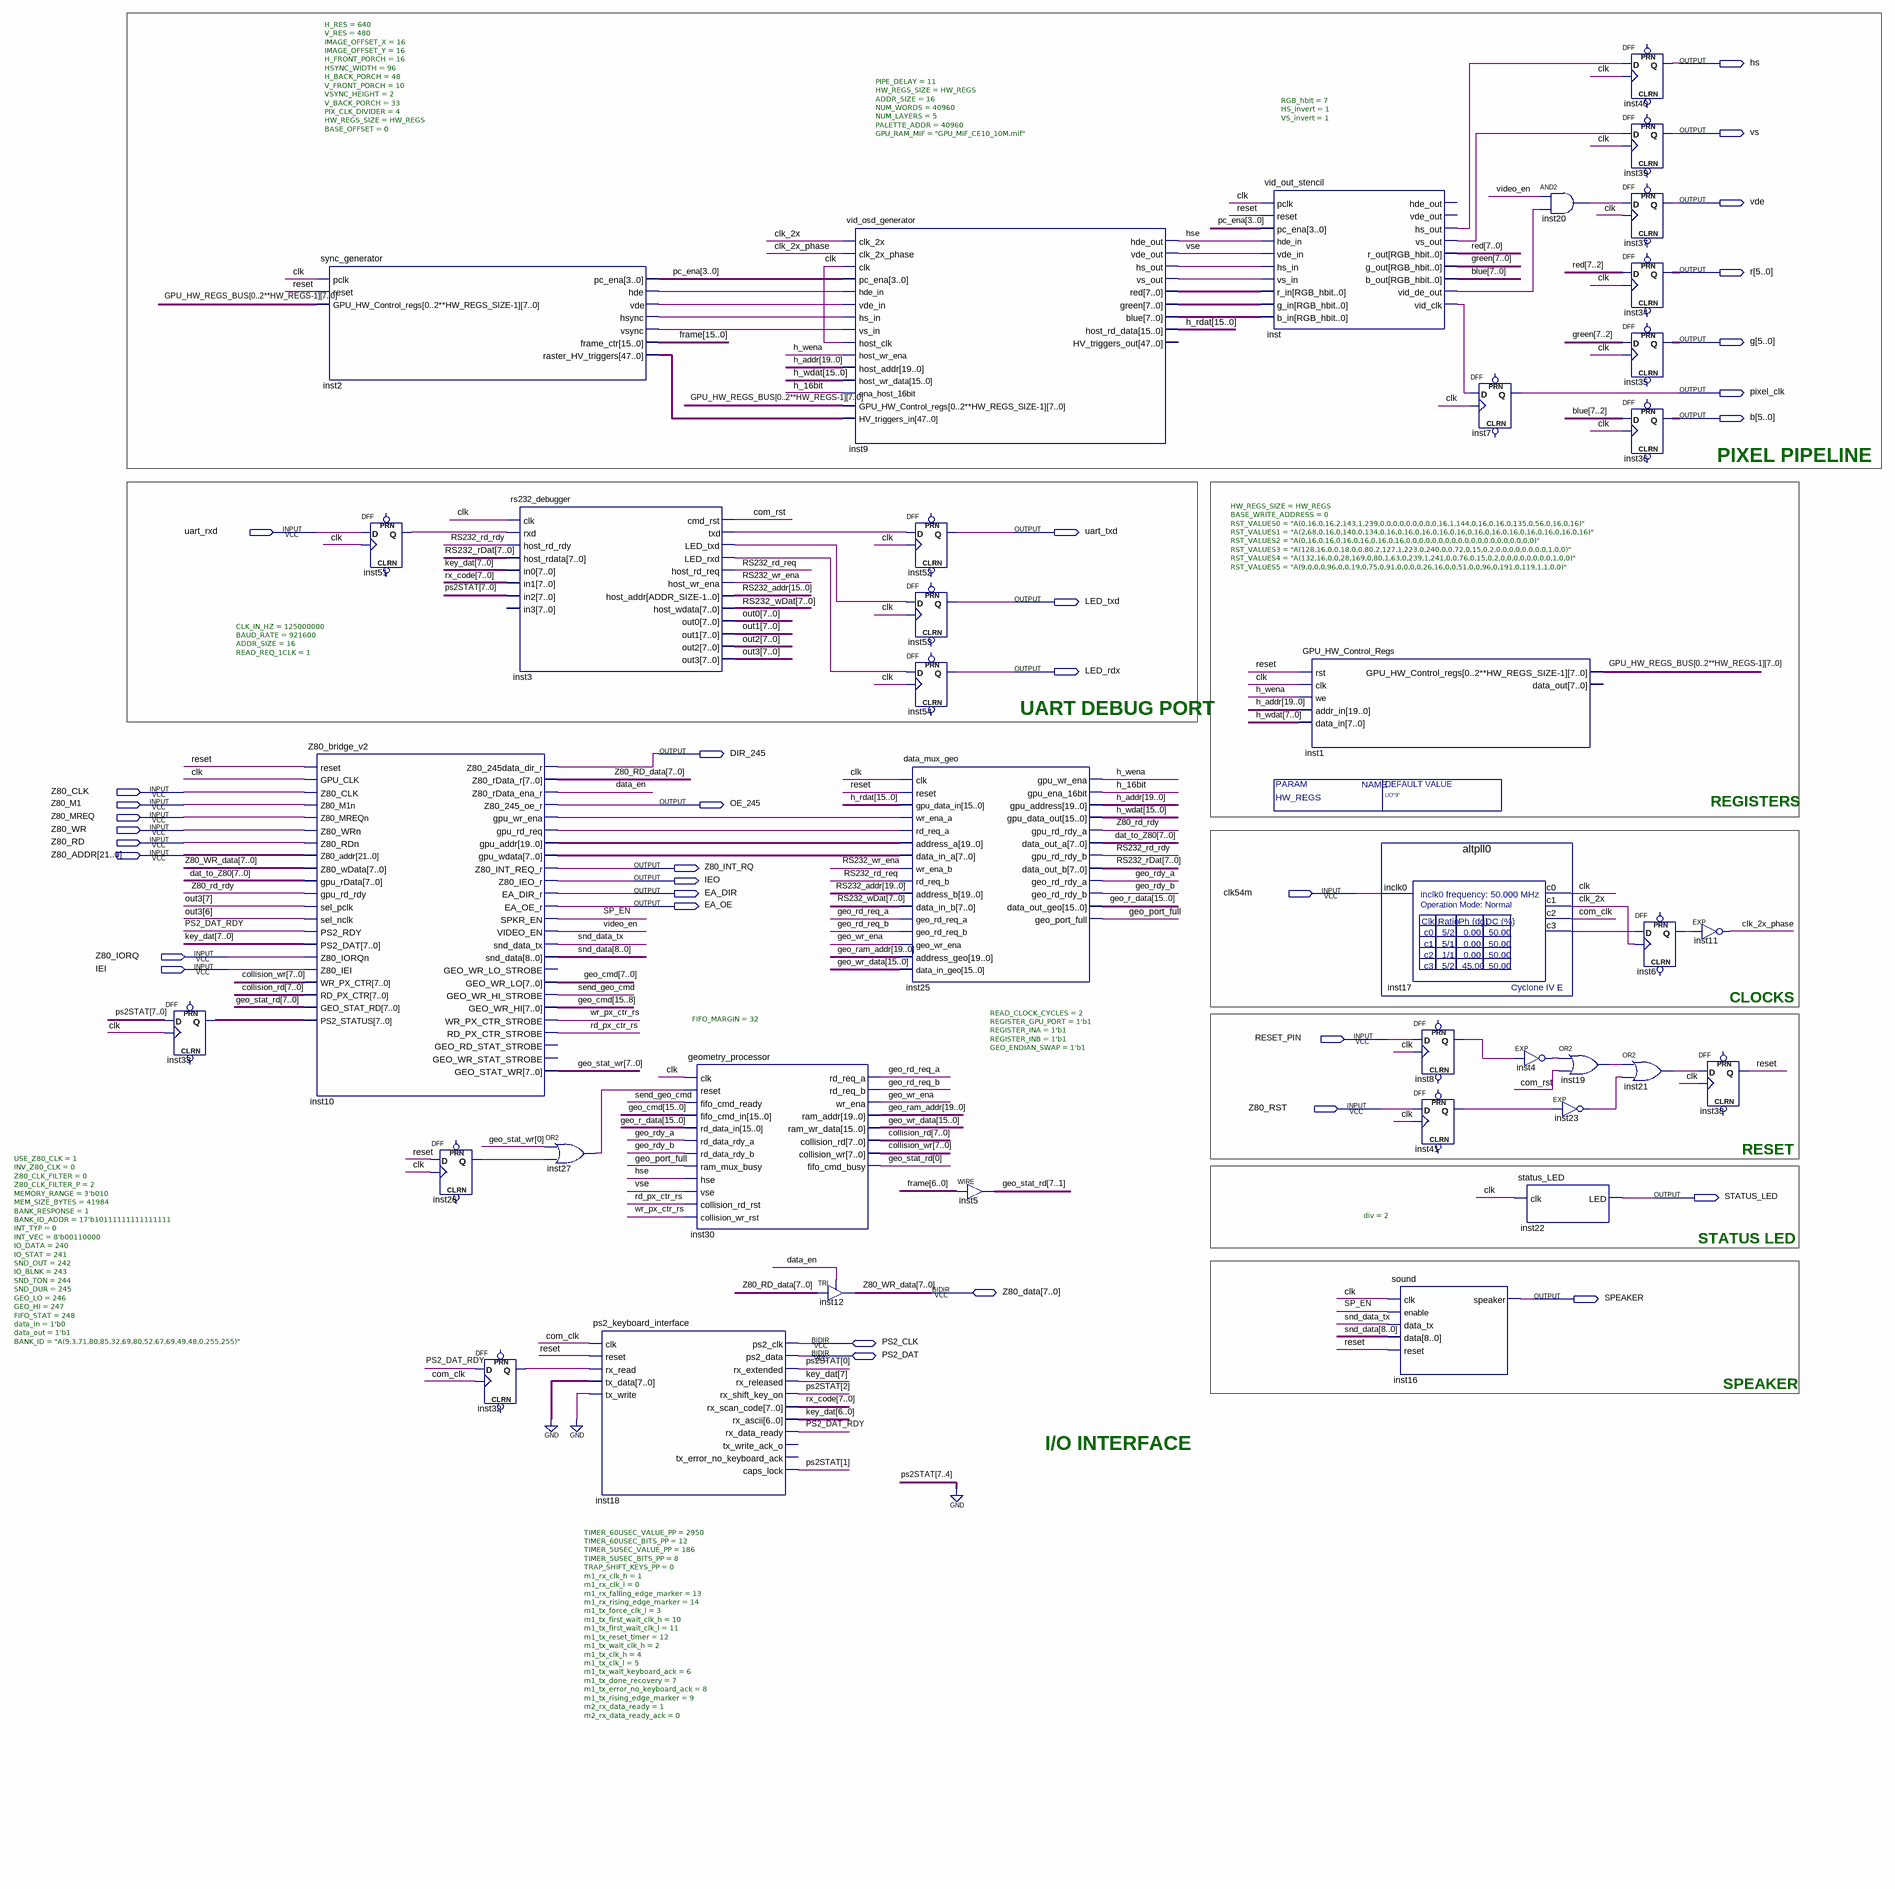
[diagram p0: schematic sheet]
// Quartus schematic GPU.bdf as structural Verilog: 39 symbols, 33 pins
module GPU #(parameter HW_REGS = "UD\"9\"") (
  input  uart_rxd,
  input  Z80_CLK,
  input  Z80_M1,
  input  Z80_MREQ,
  input  Z80_WR,
  input  Z80_RD,
  input  [21:0] Z80_ADDR,
  input  clk54m,
  input  Z80_IORQ,
  input  IEI,
  input  RESET_PIN,
  input  Z80_RST,
  inout  [7:0] Z80_data,
  inout  PS2_CLK,
  inout  PS2_DAT,
  output hs,
  output vs,
  output vde,
  output [5:0] r,
  output [5:0] g,
  output pixel_clk,
  output [5:0] b,
  output uart_txd,
  output LED_txd,
  output LED_rdx,
  output DIR_245,
  output OE_245,
  output Z80_INT_RQ,
  output IEO,
  output EA_DIR,
  output EA_OE,
  output STATUS_LED,
  output SPEAKER
);

  wire clk, clk_2x, clk_2x_phase, com_clk, com_rst, data_en, geo_port_full, geo_rd_req_a, geo_rd_req_b,
       geo_rdy_a, geo_rdy_b, geo_wr_ena, h_16bit, h_wena, hse, inst2_hde, inst2_hsync, inst2_vde,
       inst2_vsync, inst3_led_rxd, inst3_led_txd, inst3_txd, inst4_out, inst6_q, inst8_q, inst9_hs_out,
       inst9_vs_out, inst10_gpu_rd_req, inst10_gpu_wr_ena, inst17_c3, inst19_out, inst20_out, inst21_out,
       inst23_out, inst26_q, inst27_out, inst32_q, inst41_q, inst51_q, inst_hs_out, inst_vid_clk,
       inst_vid_de_out, inst_vs_out, PS2_DAT_RDY, rd_px_ctr_rs, reset, RS232_rd_rdy, RS232_rd_req,
       RS232_wr_ena, send_geo_cmd, snd_data_tx, SP_EN, video_en, vse, wr_px_ctr_rs, Z80_rd_rdy;
  wire [3:0] pc_ena, ps2STAT;
  wire [7:0] blue, collision_rd, collision_wr, dat_to_Z80, geo_stat_rd, geo_stat_wr,
       \GPU_HW_REGS_BUS[0..2**HW_REGS-1] , green, inst9_blue, inst9_green, inst9_red, inst10_gpu_wdata,
       inst33_q, key_dat, out0, out1, out2, out3, red, RS232_rDat, RS232_wDat, rx_code, Z80_RD_data;
  wire [8:0] snd_data;
  wire [15:0] frame, geo_cmd, geo_r_data, geo_wr_data, h_rdat, h_wdat;
  wire [19:0] geo_ram_addr, h_addr, inst10_gpu_addr, RS232_addr;
  wire [47:0] inst2_raster_hv_triggers;

  DFF inst33[7:0] (.CLK(clk), .D({4'b0000, ps2STAT}), .Q(inst33_q));  // open: CLRN, PRN
  sync_generator #(.H_RES(640), .V_RES(480), .IMAGE_OFFSET_X(16), .IMAGE_OFFSET_Y(16), .H_FRONT_PORCH(16), .HSYNC_WIDTH(96), .H_BACK_PORCH(48), .V_FRONT_PORCH(10), .VSYNC_HEIGHT(2), .V_BACK_PORCH(33), .PIX_CLK_DIVIDER(4), .HW_REGS_SIZE(HW_REGS), .BASE_OFFSET(0)) inst2 (
    .pclk(clk), .reset(reset), .GPU_HW_Control_regs(\GPU_HW_REGS_BUS[0..2**HW_REGS-1] ), .pc_ena(pc_ena),
    .hde(inst2_hde), .vde(inst2_vde), .hsync(inst2_hsync), .vsync(inst2_vsync), .frame_ctr(frame),
    .raster_HV_triggers(inst2_raster_hv_triggers));
  Z80_bridge_v2 #(.USE_Z80_CLK(1), .INV_Z80_CLK(0), .Z80_CLK_FILTER(0), .Z80_CLK_FILTER_P(2), .MEMORY_RANGE(3'b010), .MEM_SIZE_BYTES(41984), .BANK_RESPONSE(1), .BANK_ID_ADDR(17'b10111111111111111), .INT_TYP(0), .INT_VEC(8'b00110000), .IO_DATA(240), .IO_STAT(241), .SND_OUT(242), .IO_BLNK(243), .SND_TON(244), .SND_DUR(245), .GEO_LO(246), .GEO_HI(247), .FIFO_STAT(248), .data_in(1'b0), .data_out(1'b1), .BANK_ID("A(9,3,71,80,85,32,69,80,52,67,69,49,48,0,255,255)")) inst10 (
    .reset(reset), .GPU_CLK(clk), .Z80_CLK(Z80_CLK), .Z80_M1n(Z80_M1), .Z80_MREQn(Z80_MREQ),
    .Z80_WRn(Z80_WR), .Z80_RDn(Z80_RD), .Z80_addr(Z80_ADDR), .Z80_wData(Z80_data), .gpu_rData(dat_to_Z80),
    .gpu_rd_rdy(Z80_rd_rdy), .sel_pclk(out3[7]), .sel_nclk(out3[6]), .PS2_RDY(PS2_DAT_RDY),
    .PS2_DAT(key_dat), .Z80_IORQn(Z80_IORQ), .Z80_IEI(IEI), .WR_PX_CTR(collision_wr),
    .RD_PX_CTR(collision_rd), .GEO_STAT_RD(geo_stat_rd), .PS2_STATUS(inst33_q), .Z80_245data_dir_r(DIR_245),
    .Z80_rData_r(Z80_RD_data), .Z80_rData_ena_r(data_en), .Z80_245_oe_r(OE_245),
    .gpu_wr_ena(inst10_gpu_wr_ena), .gpu_rd_req(inst10_gpu_rd_req), .gpu_addr(inst10_gpu_addr),
    .gpu_wdata(inst10_gpu_wdata), .Z80_INT_REQ_r(Z80_INT_RQ), .Z80_IEO_r(IEO), .EA_DIR_r(EA_DIR),
    .EA_OE_r(EA_OE), .SPKR_EN(SP_EN), .VIDEO_EN(video_en), .snd_data_tx(snd_data_tx), .snd_data(snd_data),
    .GEO_WR_LO(geo_cmd[7:0]), .GEO_WR_HI_STROBE(send_geo_cmd), .GEO_WR_HI(geo_cmd[15:8]),
    .WR_PX_CTR_STROBE(wr_px_ctr_rs), .RD_PX_CTR_STROBE(rd_px_ctr_rs), .GEO_STAT_WR(geo_stat_wr));  // open: GEO_WR_LO_STROBE, GEO_RD_STAT_STROBE, GEO_WR_STAT_STROBE
  DFF inst51 (.CLK(clk), .D(uart_rxd), .Q(inst51_q));  // open: CLRN, PRN
  DFF inst26 (.CLK(clk), .D(reset), .Q(inst26_q));  // open: CLRN, PRN
  DFF inst32 (.CLK(com_clk), .D(PS2_DAT_RDY), .Q(inst32_q));  // open: CLRN, PRN
  rs232_debugger #(.CLK_IN_HZ(125000000), .BAUD_RATE(921600), .ADDR_SIZE(16), .READ_REQ_1CLK(1)) inst3 (
    .clk(clk), .rxd(inst51_q), .host_rd_rdy(RS232_rd_rdy), .host_rdata(RS232_rDat), .in0(key_dat),
    .in1(rx_code), .in2({4'b0000, ps2STAT}), .cmd_rst(com_rst), .txd(inst3_txd), .LED_txd(inst3_led_txd),
    .LED_rxd(inst3_led_rxd), .host_rd_req(RS232_rd_req), .host_wr_ena(RS232_wr_ena),
    .host_addr(RS232_addr[15:0]), .host_wdata(RS232_wDat), .out0(out0), .out1(out1), .out2(out2), .out3(out3));  // open: in3
  or inst27 (inst27_out, geo_stat_wr[0], inst26_q);
  ps2_keyboard_interface #(.TIMER_60USEC_VALUE_PP(2950), .TIMER_60USEC_BITS_PP(12), .TIMER_5USEC_VALUE_PP(186), .TIMER_5USEC_BITS_PP(8), .TRAP_SHIFT_KEYS_PP(0), .m1_rx_clk_h(1), .m1_rx_clk_l(0), .m1_rx_falling_edge_marker(13), .m1_rx_rising_edge_marker(14), .m1_tx_force_clk_l(3), .m1_tx_first_wait_clk_h(10), .m1_tx_first_wait_clk_l(11), .m1_tx_reset_timer(12), .m1_tx_wait_clk_h(2), .m1_tx_clk_h(4), .m1_tx_clk_l(5), .m1_tx_wait_keyboard_ack(6), .m1_tx_done_recovery(7), .m1_tx_error_no_keyboard_ack(8), .m1_tx_rising_edge_marker(9), .m2_rx_data_ready(1), .m2_rx_data_ready_ack(0)) inst18 (
    .clk(com_clk), .reset(reset), .rx_read(inst32_q), .tx_data({8{1'b0}}), .tx_write(1'b0),
    .rx_extended(ps2STAT[0]), .rx_released(key_dat[7]), .rx_shift_key_on(ps2STAT[2]), .rx_scan_code(rx_code),
    .rx_ascii(key_dat[6:0]), .rx_data_ready(PS2_DAT_RDY), .caps_lock(ps2STAT[1]), .ps2_clk(PS2_CLK),
    .ps2_data(PS2_DAT));  // open: tx_write_ack_o, tx_error_no_keyboard_ack
  geometry_processor #(.FIFO_MARGIN(32)) inst30 (
    .clk(clk), .reset(inst27_out), .fifo_cmd_ready(send_geo_cmd), .fifo_cmd_in(geo_cmd),
    .rd_data_in(geo_r_data), .rd_data_rdy_a(geo_rdy_a), .rd_data_rdy_b(geo_rdy_b),
    .ram_mux_busy(geo_port_full), .hse(hse), .vse(vse), .collision_rd_rst(rd_px_ctr_rs),
    .collision_wr_rst(wr_px_ctr_rs), .rd_req_a(geo_rd_req_a), .rd_req_b(geo_rd_req_b), .wr_ena(geo_wr_ena),
    .ram_addr(geo_ram_addr), .ram_wr_data(geo_wr_data), .collision_rd(collision_rd),
    .collision_wr(collision_wr), .fifo_cmd_busy(geo_stat_rd[0]));
  vid_osd_generator #(.PIPE_DELAY(11), .HW_REGS_SIZE(HW_REGS), .ADDR_SIZE(16), .NUM_WORDS(40960), .NUM_LAYERS(5), .PALETTE_ADDR(40960), .GPU_RAM_MIF("GPU_MIF_CE10_10M.mif")) inst9 (
    .clk_2x(clk_2x), .clk_2x_phase(clk_2x_phase), .clk(clk), .pc_ena(pc_ena), .hde_in(inst2_hde),
    .vde_in(inst2_vde), .hs_in(inst2_hsync), .vs_in(inst2_vsync), .host_clk(clk), .host_wr_ena(h_wena),
    .host_addr(h_addr), .host_wr_data(h_wdat), .ena_host_16bit(h_16bit),
    .GPU_HW_Control_regs(\GPU_HW_REGS_BUS[0..2**HW_REGS-1] ), .HV_triggers_in(inst2_raster_hv_triggers),
    .hde_out(hse), .vde_out(vse), .hs_out(inst9_hs_out), .vs_out(inst9_vs_out), .red(inst9_red),
    .green(inst9_green), .blue(inst9_blue), .host_rd_data(h_rdat));  // open: HV_triggers_out
  TRI inst12[7:0] (.IN(Z80_RD_data), .OE(data_en), .OUT(Z80_data));
  DFF inst52 (.CLK(clk), .D(inst3_txd), .Q(uart_txd));  // open: CLRN, PRN
  DFF inst53 (.CLK(clk), .D(inst3_led_txd), .Q(LED_txd));  // open: CLRN, PRN
  DFF inst54 (.CLK(clk), .D(inst3_led_rxd), .Q(LED_rdx));  // open: CLRN, PRN
  data_mux_geo #(.READ_CLOCK_CYCLES(2), .REGISTER_GPU_PORT(1'b1), .REGISTER_INA(1'b1), .REGISTER_INB(1'b1), .GEO_ENDIAN_SWAP(1'b1)) inst25 (
    .clk(clk), .reset(reset), .gpu_data_in(h_rdat), .wr_ena_a(inst10_gpu_wr_ena),
    .rd_req_a(inst10_gpu_rd_req), .address_a(inst10_gpu_addr), .data_in_a(inst10_gpu_wdata),
    .wr_ena_b(RS232_wr_ena), .rd_req_b(RS232_rd_req), .address_b(RS232_addr), .data_in_b(RS232_wDat),
    .geo_rd_req_a(geo_rd_req_a), .geo_rd_req_b(geo_rd_req_b), .geo_wr_ena(geo_wr_ena),
    .address_geo(geo_ram_addr), .data_in_geo(geo_wr_data), .gpu_wr_ena(h_wena), .gpu_ena_16bit(h_16bit),
    .gpu_address(h_addr), .gpu_data_out(h_wdat), .gpu_rd_rdy_a(Z80_rd_rdy), .data_out_a(dat_to_Z80),
    .gpu_rd_rdy_b(RS232_rd_rdy), .data_out_b(RS232_rDat), .geo_rd_rdy_a(geo_rdy_a), .geo_rd_rdy_b(geo_rdy_b),
    .data_out_geo(geo_r_data), .geo_port_full(geo_port_full));
  assign geo_stat_rd[7:1] = frame[6:0];  // WIRE inst5
  vid_out_stencil #(.RGB_hbit(7), .HS_invert(1), .VS_invert(1)) inst (
    .pclk(clk), .reset(reset), .pc_ena(pc_ena), .hde_in(hse), .vde_in(vse), .hs_in(inst9_hs_out),
    .vs_in(inst9_vs_out), .r_in(inst9_red), .g_in(inst9_green), .b_in(inst9_blue), .hs_out(inst_hs_out),
    .vs_out(inst_vs_out), .r_out(red), .g_out(green), .b_out(blue), .vid_de_out(inst_vid_de_out),
    .vid_clk(inst_vid_clk));  // open: hde_out, vde_out
  GPU_HW_Control_Regs #(.HW_REGS_SIZE(HW_REGS), .BASE_WRITE_ADDRESS(0), .RST_VALUES0("A(0,16,0,16,2,143,1,239,0,0,0,0,0,0,0,0,0,16,1,144,0,16,0,16,0,135,0,56,0,16,0,16)"), .RST_VALUES1("A(2,68,0,16,0,140,0,134,0,16,0,16,0,16,0,16,0,16,0,16,0,16,0,16,0,16,0,16,0,16,0,16)"), .RST_VALUES2("A(0,16,0,16,0,16,0,16,0,16,0,16,0,0,0,0,0,0,0,0,0,0,0,0,0,0,0,0,0,0,0,0)"), .RST_VALUES3("A(128,16,0,0,18,0,0,80,2,127,1,223,0,240,0,0,72,0,15,0,2,0,0,0,0,0,0,0,0,1,0,0)"), .RST_VALUES4("A(132,16,0,0,28,169,0,80,1,63,0,239,1,241,0,0,76,0,15,0,2,0,0,0,0,0,0,0,0,1,0,0)"), .RST_VALUES5("A(9,0,0,0,96,0,0,19,0,75,0,91,0,0,0,0,26,16,0,0,51,0,0,96,0,191,0,119,1,1,0,0)")) inst1 (
    .rst(reset), .clk(clk), .we(h_wena), .addr_in(h_addr), .data_in(h_wdat[7:0]),
    .GPU_HW_Control_regs(\GPU_HW_REGS_BUS[0..2**HW_REGS-1] ));  // open: data_out
  altpll0 inst17 (.inclk0(clk54m), .c0(clk), .c1(clk_2x), .c2(com_clk), .c3(inst17_c3));
  sound inst16 (.clk(clk), .enable(SP_EN), .data_tx(snd_data_tx), .data(snd_data), .reset(reset), .speaker(SPEAKER));
  DFF inst8 (.CLK(clk), .D(RESET_PIN), .Q(inst8_q));  // open: CLRN, PRN
  DFF inst41 (.CLK(clk), .D(Z80_RST), .Q(inst41_q));  // open: CLRN, PRN
  DFF inst7 (.CLK(clk), .D(inst_vid_clk), .Q(pixel_clk));  // open: CLRN, PRN
  and inst20 (inst20_out, video_en, inst_vid_de_out);
  EXP inst4 (.IN(inst8_q), .OUT(inst4_out));
  EXP inst23 (.IN(inst41_q), .OUT(inst23_out));
  status_LED #(.div(2)) inst22 (.clk(clk), .LED(STATUS_LED));
  or inst19 (inst19_out, inst4_out, com_rst);
  DFF inst40 (.CLK(clk), .D(inst_hs_out), .Q(hs));  // open: CLRN, PRN
  DFF inst39 (.CLK(clk), .D(inst_vs_out), .Q(vs));  // open: CLRN, PRN
  DFF inst37 (.CLK(clk), .D(inst20_out), .Q(vde));  // open: CLRN, PRN
  DFF inst34[5:0] (.CLK(clk), .D(red[7:2]), .Q(r));  // open: CLRN, PRN
  DFF inst35[5:0] (.CLK(clk), .D(green[7:2]), .Q(g));  // open: CLRN, PRN
  DFF inst36[5:0] (.CLK(clk), .D(blue[7:2]), .Q(b));  // open: CLRN, PRN
  DFF inst6 (.CLK(clk_2x), .D(inst17_c3), .Q(inst6_q));  // open: CLRN, PRN
  or inst21 (inst21_out, inst19_out, inst23_out);
  EXP inst11 (.IN(inst6_q), .OUT(clk_2x_phase));
  DFF inst38 (.CLK(clk), .D(inst21_out), .Q(reset));  // open: CLRN, PRN

  // Other names for the same wires on the sheet: Z80_WR_data[7:0] = Z80_data

  // Notes on the sheet:
  //   PIXEL PIPELINE
  //   UART DEBUG PORT
  //   REGISTERS
  //   CLOCKS
  //   RESET
  //   STATUS LED
  //   SPEAKER
  //   I/O INTERFACE
endmodule
